# Altium schematic sheet HUT BUI.SchDoc
size A
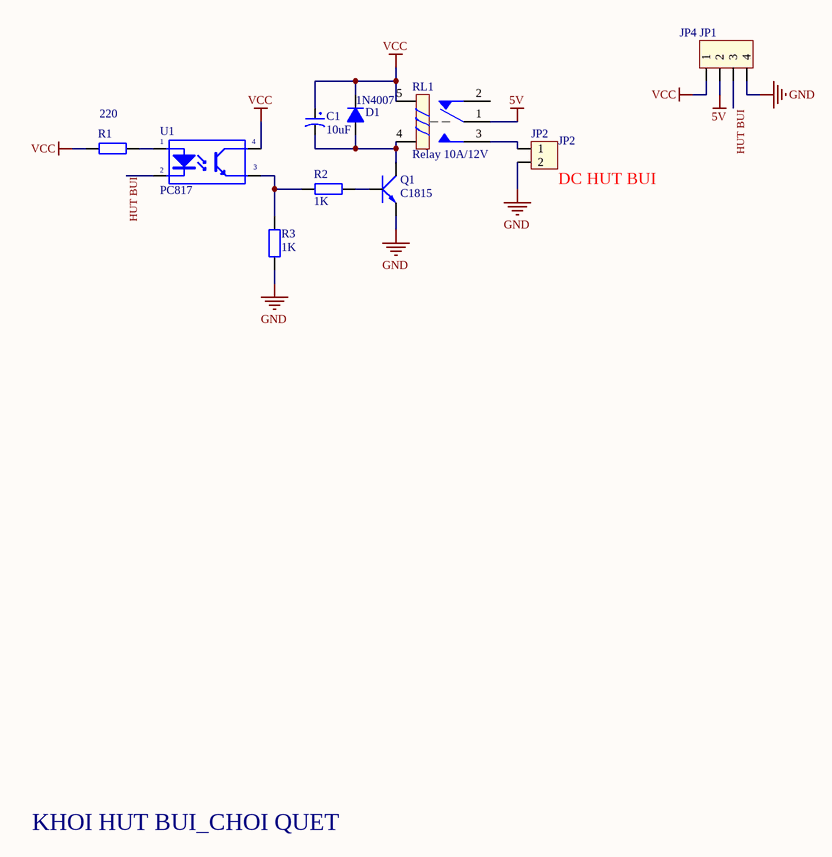
[diagram p0: HUT BUI.SchDoc]

## Parts
C1  10uF  [CP1/2]
D1  1N4007  [D1A]
JP1  JP4  [CON4]
JP2  JP2  [CON2]
Q1  C1815  [QTO-92]
R1  220  [R1/4W]
R2  1K  [R1/4W]
R3  1K  [R1/4W]
RL1  Relay 10A/12V  [RL_SPDT_10A]
U1  PC817  [DIP4/W0.3]

## Nets
5V: JP1.2 RL1.1
GND: JP1.4 JP2.2 Q1.1(E) R3.1
VCC: C1.1 D1.2(K) JP1.1 R1.1 RL1.5 U1.4(C)
HUT BUI: JP1.3 U1.2(K)
NetC1_2: C1.2 D1.1(A) Q1.2(C) RL1.4
NetJP2_1: JP2.1 RL1.3
NetQ1_3: Q1.3(B) R2.1
NetR1_2: R1.2 U1.1(A)
NetR2_2: R2.2 R3.2 U1.3(E)

Not connected (* = marked no-connect by the designer): RL1 2

## Notes on the sheet
- (near JP2) DC HUT BUI
- KHOI HUT BUI_CHOI QUET

## Library data of the parts
C1 = CP1: Cap P  0,1uF < 22uF , 16 - 50V; Value: 10uF/50V; Description 1: 10 => 220uF/6,3V/10V - 10uF => 100uF/16V; Description 2: 0,1uF => 33uF/50V - 10uF => 22uF/63V; Description 3: 0,47uF => 10uF/100V
D1 = D1A: Diode 1A; Value: 1N4007
JP1 = Con4: Connector 4; Value: Connector 4
JP2 = Con2: Connector 2; Value: Connector 2
Q1 = C1815: NPN 600mW, ECB; Value: C1815
R1-R3 = R1/4W: Resistor 1/4W; Value: R1/4W - 1K
RL1 = Relay 1: Relay SPDT,10A - 12VDC 5 Pin; Value: Relay SPDT, 10A, 12V
U1 = PC817: Single Opto; Value: PC817